# Altium schematic sheet Fusing_Connectors.SchDoc
size A3
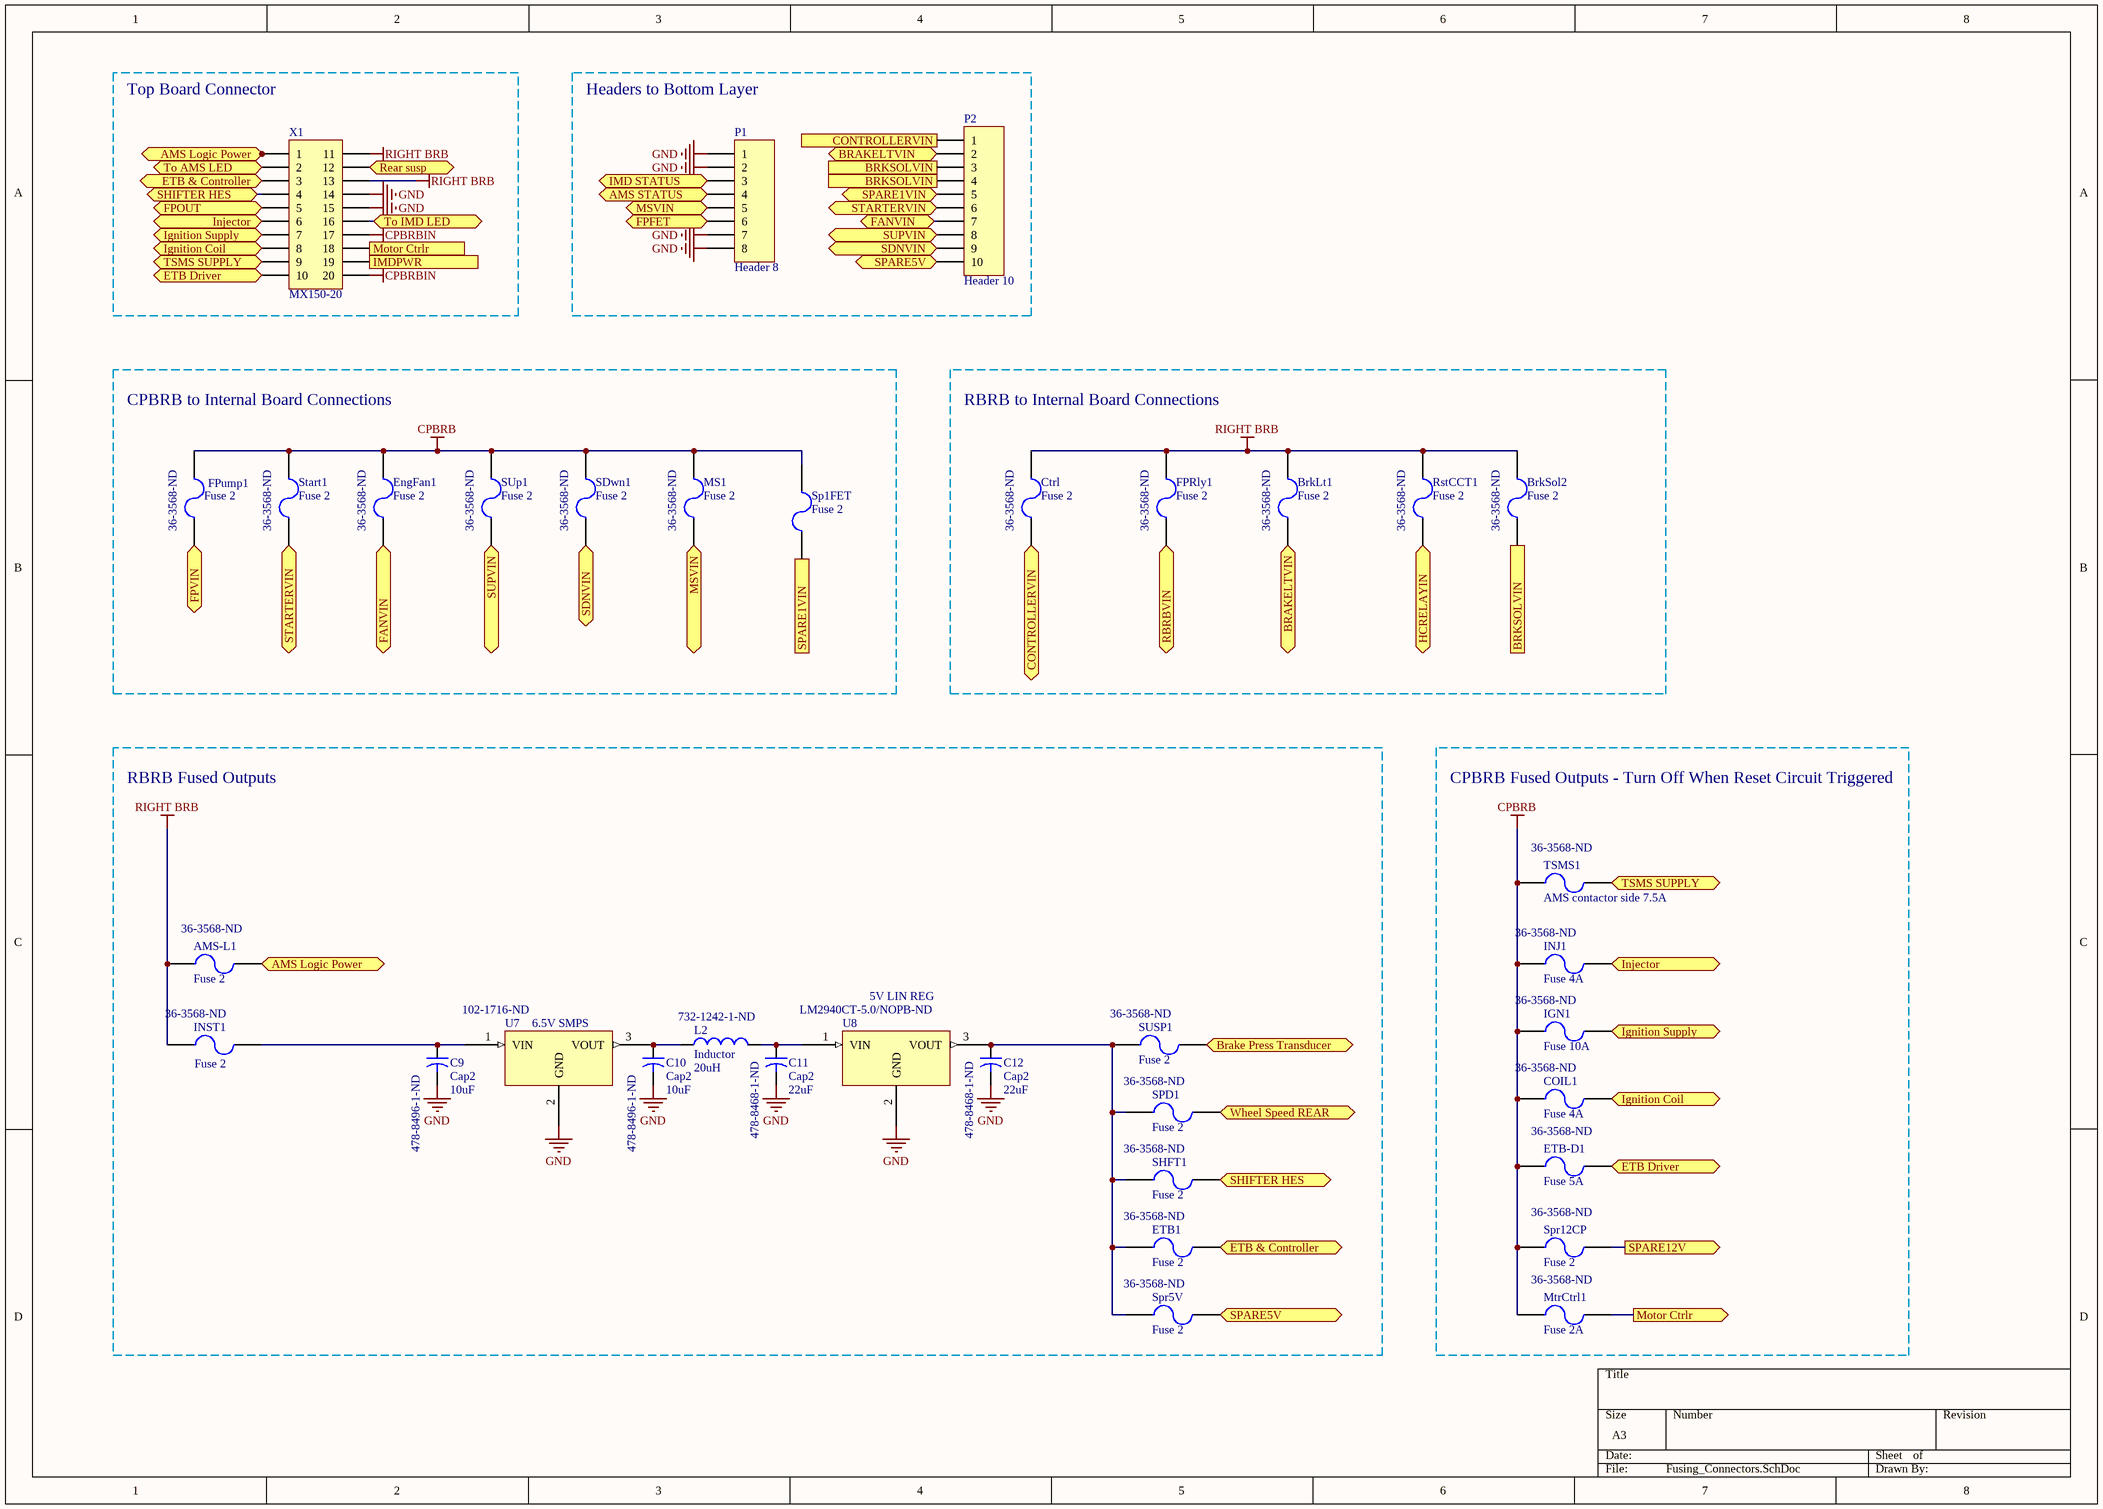
[diagram p0: Fusing_Connectors.SchDoc]

## Parts
AMS-L1  Fuse 2  Supplier Part Number 1: 36-3568-ND  [Fuse Holder Mini ATC/ATO]
BrkLt1  Fuse 2  Supplier Part Number 1: 36-3568-ND  [FUSE HOLDER MINI ATC/ATO]
BrkSol2  Fuse 2  Supplier Part Number 1: 36-3568-ND  [FUSE HOLDER MINI ATC/ATO]
C9  Cap2  value 10uF  Supplier Part Number 1: 478-8496-1-ND  [C1206]
C10  Cap2  value 10uF  Supplier Part Number 1: 478-8496-1-ND  [C1206]
C11  Cap2  value 22uF  Supplier Part Number 1: 478-8468-1-ND  [1206]
C12  Cap2  value 22uF  Supplier Part Number 1: 478-8468-1-ND  [1206]
COIL1  Fuse 4A  Supplier Part Number 1: 36-3568-ND  [Fuse Holder Mini ATC/ATO]
Ctrl  Fuse 2  Supplier Part Number 1: 36-3568-ND  [FUSE HOLDER MINI ATC/ATO]
EngFan1  Fuse 2  Supplier Part Number 1: 36-3568-ND  [FUSE HOLDER MINI ATC/ATO]
ETB1  Fuse 2  Supplier Part Number 1: 36-3568-ND  [Fuse Holder Mini ATC/ATO]
ETB-D1  Fuse 5A  Supplier Part Number 1: 36-3568-ND  [Fuse Holder Mini ATC/ATO]
FPRly1  Fuse 2  Supplier Part Number 1: 36-3568-ND  [FUSE HOLDER MINI ATC/ATO]
FPump1  Fuse 2  Supplier Part Number 1: 36-3568-ND  [FUSE HOLDER MINI ATC/ATO]
IGN1  Fuse 10A  Supplier Part Number 1: 36-3568-ND  [Fuse Holder Mini ATC/ATO]
INJ1  Fuse 4A  Supplier Part Number 1: 36-3568-ND  [Fuse Holder Mini ATC/ATO]
INST1  Fuse 2  Supplier Part Number 1: 36-3568-ND  [Fuse Holder Mini ATC/ATO]
L2  Inductor  value 20uH  Supplier Part Number 1: 732-1242-1-ND  [FILTER INDUCTOR]
MS1  Fuse 2  Supplier Part Number 1: 36-3568-ND  [FUSE HOLDER MINI ATC/ATO]
MtrCtrl1  Fuse 2A  Supplier Part Number 1: 36-3568-ND  [Fuse Holder Mini ATC/ATO]
P1  Header 8  [HDR1X8]
P2  Header 10  [HDR1X10]
RstCCT1  Fuse 2  Supplier Part Number 1: 36-3568-ND  [FUSE HOLDER MINI ATC/ATO]
SDwn1  Fuse 2  Supplier Part Number 1: 36-3568-ND  [FUSE HOLDER MINI ATC/ATO]
SHFT1  Fuse 2  Supplier Part Number 1: 36-3568-ND  [FUSE HOLDER MINI ATC/ATO]
Sp1FET  Fuse 2  [FUSE HOLDER MINI ATC/ATO]
SPD1  Fuse 2  Supplier Part Number 1: 36-3568-ND  [Fuse Holder Mini ATC/ATO]
Spr5V  Fuse 2  Supplier Part Number 1: 36-3568-ND  [Fuse Holder Mini ATC/ATO]
Spr12CP  Fuse 2  Supplier Part Number 1: 36-3568-ND  [Fuse Holder Mini ATC/ATO]
Start1  Fuse 2  Supplier Part Number 1: 36-3568-ND  [FUSE HOLDER MINI ATC/ATO]
SUp1  Fuse 2  Supplier Part Number 1: 36-3568-ND  [FUSE HOLDER MINI ATC/ATO]
SUSP1  Fuse 2  Supplier Part Number 1: 36-3568-ND  [Fuse Holder Mini ATC/ATO]
TSMS1  AMS contactor side 7.5A  Supplier Part Number 1: 36-3568-ND  [Fuse Holder Mini ATC/ATO]
U7  6.5V SMPS  Supplier Part Number 1: 102-1716-ND  [V7806-1000]
U8  5V LIN REG  Supplier Part Number 1: LM2940CT-5.0/NOPB-ND  [TO-220-3]
X1  MX150-20  [20 Pin MX150]

## Blocks framed on the sheet
Top Board Connector: X1
Headers to Bottom Layer: P1 P2
CPBRB to Internal Board Connections: EngFan1 FPump1 MS1 SDwn1 Sp1FET Start1 SUp1
RBRB to Internal Board Connections: BrkLt1 BrkSol2 Ctrl FPRly1 RstCCT1
RBRB Fused Outputs: AMS-L1 C9-C12 ETB1 INST1 L2 SHFT1 SPD1 Spr5V SUSP1 U7 U8
CPBRB Fused Outputs - Turn Off When Reset Circuit Triggered: COIL1 ETB-D1 IGN1 INJ1 MtrCtrl1 Spr12CP TSMS1

## Ports
AMS Logic Power (bidir), AMS STATUS (bidir), Brake Press Transducer (bidir), BRAKELTVIN (bidir), BRKSOLVIN, CONTROLLERVIN, CONTROLLERVIN (bidir), ETB & Controller (bidir), ETB Driver (bidir), FANVIN (bidir), FPFET (bidir), FPOUT (bidir), FPVIN (bidir), HCRELAYIN (bidir), Ignition Coil (bidir), Ignition Supply (bidir), IMD STATUS (bidir), IMDPWR (out), Injector (bidir), Motor Ctrlr (out), MSVIN (bidir), RBRBVIN (bidir), Rear susp (bidir), SDNVIN (bidir), SHIFTER HES (bidir), SPARE1VIN, SPARE1VIN (bidir), SPARE5V (bidir), SPARE12V (out), STARTERVIN (bidir), SUPVIN (bidir), To AMS LED (bidir), To IMD LED (bidir), TSMS SUPPLY (bidir), Wheel Speed REAR (bidir)

## Nets
CPBRB: COIL1.2 EngFan1.2 ETB-D1.2 FPump1.2 IGN1.2 INJ1.2 MS1.2 MtrCtrl1.2 SDwn1.2 Sp1FET.2 Spr12CP.2 Start1.2 SUp1.2 TSMS1.2
CPBRBIN: X1.17 X1.20
GND: C9.2 C10.2 C11.2 C12.2 P1.1 P1.2 P1.7 P1.8 U7.2(GND) U8.2(GND) X1.14 X1.15
RIGHT BRB: AMS-L1.2 BrkLt1.2 BrkSol2.2 Ctrl.2 FPRly1.2 INST1.2 RstCCT1.2 X1.11 X1.13
AMS Logic Power: AMS-L1.1 ; port AMS Logic Power
AMS STATUS: P1.4 ; port AMS STATUS
Brake Press Transducer: SUSP1.1 ; port Brake Press Transducer
BRAKELTVIN: BrkLt1.1 P2.2 ; port BRAKELTVIN
BRKSOLVIN: BrkSol2.1 P2.3 P2.4 ; port BRKSOLVIN
CONTROLLERVIN: Ctrl.1 P2.1 ; port CONTROLLERVIN
ETB & Controller: ETB1.1 X1.3 ; port ETB & Controller
ETB Driver: ETB-D1.1 X1.10 ; port ETB Driver
FANVIN: EngFan1.1 P2.7 ; port FANVIN
FPFET: P1.6 ; port FPFET
FPOUT: X1.5 ; port FPOUT
FPVIN: FPump1.1 ; port FPVIN
HCRELAYIN: RstCCT1.1 ; port HCRELAYIN
Ignition Coil: COIL1.1 X1.8 ; port Ignition Coil
Ignition Supply: IGN1.1 X1.7 ; port Ignition Supply
IMD STATUS: P1.3 ; port IMD STATUS
IMDPWR: X1.19 ; port IMDPWR
Injector: INJ1.1 X1.6 ; port Injector
Motor Ctrlr: MtrCtrl1.1 X1.18 ; port Motor Ctrlr
MSVIN: MS1.1 P1.5 ; port MSVIN
RBRBVIN: FPRly1.1 ; port RBRBVIN
Rear susp: X1.12 ; port Rear susp
SDNVIN: P2.9 SDwn1.1 ; port SDNVIN
SHIFTER HES: SHFT1.1 X1.4 ; port SHIFTER HES
SPARE1VIN: P2.5 Sp1FET.1 ; port SPARE1VIN
SPARE5V: P2.10 Spr5V.1 ; port SPARE5V
SPARE12V: Spr12CP.1 ; port SPARE12V
STARTERVIN: P2.6 Start1.1 ; port STARTERVIN
SUPVIN: P2.8 SUp1.1 ; port SUPVIN
To AMS LED: X1.2 ; port To AMS LED
To IMD LED: X1.16 ; port To IMD LED
TSMS SUPPLY: TSMS1.1 X1.9 ; port TSMS SUPPLY
Wheel Speed REAR: SPD1.1 ; port Wheel Speed REAR
NetC9_1: C9.1 INST1.1 U7.1(VIN)
NetC10_1: C10.1 L2.1 U7.3(VOUT)
NetC11_1: C11.1 L2.2 U8.1(VIN)
NetC12_1: C12.1 ETB1.2 SHFT1.2 SPD1.2 Spr5V.2 SUSP1.2 U8.3(VOUT)

Not connected (* = marked no-connect by the designer): X1 1

## Library data of the parts
AMS-L1 BrkLt1 BrkSol2 Ctrl EngFan1 ETB1 FPump1 INST1 RstCCT1 SDwn1 SHFT1 Sp1FET SPD1 Spr5V Start1 SUp1 SUSP1 = Fuse 2: Fuse; Published: 8-Jun-2000; LatestRevisionDate: 17-Jul-2002; LatestRevisionNote: Re-released for DXP Platform.; PackageReference: PIN-W2/E2.8; Publisher: Altium Limited; PackageDescription: Thru-Hole; 2 Leads; Supplier 1: Digi-Key
  AMS-L1 ETB1 INST1 SHFT1 SPD1 Spr5V SUSP1: Supplier 2: Digi-Key
  Sp1FET: Supplier Part Number 1: 36-3568-ND
C9 = Cap2: Capacitor. Ceramic 10uF 50V rating recommended, place close to pin; Published: 23-Sep-2002; PackageReference: CAPR5-4X5; Publisher: Altium Limited; PackageDescription: Capacitor; 2 Leads; Supplier 1: Digi-Key
C10 = Cap2: Capacitor. Ceramic 10uF 16V recommended. place close to pin; Published: 23-Sep-2002; PackageReference: CAPR5-4X5; Publisher: Altium Limited; PackageDescription: Capacitor; 2 Leads; Supplier 1: Digi-Key
C11 C12 = Cap2: Capacitor; Published: 23-Sep-2002; PackageReference: CAPR5-4X5; Publisher: Altium Limited; PackageDescription: Capacitor; 2 Leads; Supplier 1: Digi-Key
COIL1 = Fuse 2: Fuse Ignition Coil 4A; Published: 8-Jun-2000; LatestRevisionDate: 17-Jul-2002; LatestRevisionNote: Re-released for DXP Platform.; PackageReference: PIN-W2/E2.8; Publisher: Altium Limited; PackageDescription: Thru-Hole; 2 Leads; Supplier 1: Digi-Key; Supplier 2: Digi-Key
ETB-D1 = Fuse 2: Fuse 5A ETB driver; Published: 8-Jun-2000; LatestRevisionDate: 17-Jul-2002; LatestRevisionNote: Re-released for DXP Platform.; PackageReference: PIN-W2/E2.8; Publisher: Altium Limited; PackageDescription: Thru-Hole; 2 Leads; Supplier 1: Digi-Key; Supplier 2: Digi-Key
FPRly1 = Fuse 2: Fuse Relay Coils; Published: 8-Jun-2000; LatestRevisionDate: 17-Jul-2002; LatestRevisionNote: Re-released for DXP Platform.; PackageReference: PIN-W2/E2.8; Publisher: Altium Limited; PackageDescription: Thru-Hole; 2 Leads; Supplier 1: Digi-Key
IGN1 = Fuse 2: Fuse 10A ignition; Published: 8-Jun-2000; LatestRevisionDate: 17-Jul-2002; LatestRevisionNote: Re-released for DXP Platform.; PackageReference: PIN-W2/E2.8; Publisher: Altium Limited; PackageDescription: Thru-Hole; 2 Leads; Supplier 1: Digi-Key; Supplier 2: Digi-Key
INJ1 = Fuse 2: Published: 8-Jun-2000; LatestRevisionDate: 17-Jul-2002; LatestRevisionNote: Re-released for DXP Platform.; PackageReference: PIN-W2/E2.8; Publisher: Altium Limited; PackageDescription: Thru-Hole; 2 Leads; Supplier 1: Digi-Key; Supplier 2: Digi-Key
L2 = Inductor: Code_IEC: 1005; Published: 8-Jun-2000; LatestRevisionDate: 29-May-2009; LatestRevisionNote: IPC-7351 Footprint Added.; PackageReference: 0402-A; Publisher: Altium Limited; PackageDescription: Chip Inductor; Code_JEITA: 0402; Supplier 1: Digi-Key
MS1 = Fuse 2: Microsquirt fuse; Published: 8-Jun-2000; LatestRevisionDate: 17-Jul-2002; LatestRevisionNote: Re-released for DXP Platform.; PackageReference: PIN-W2/E2.8; Publisher: Altium Limited; PackageDescription: Thru-Hole; 2 Leads; Supplier 1: Digi-Key
MtrCtrl1 = Fuse 2: Fuse 2A Motor Controller; Published: 8-Jun-2000; LatestRevisionDate: 17-Jul-2002; LatestRevisionNote: Re-released for DXP Platform.; PackageReference: PIN-W2/E2.8; Publisher: Altium Limited; PackageDescription: Thru-Hole; 2 Leads; Supplier 1: Digi-Key; Supplier 2: Digi-Key
P1 = Header 8: Header, 8-Pin; LatestRevisionDate: 17-Jul-2002; LatestRevisionNote: Re-released for DXP Platform.; Publisher: Altium Limited; Supplier Part Number 1: 952-2121-ND; Supplier 1: Digi-Key
P2 = Header 10: Header, 10-Pin; LatestRevisionDate: 17-Jul-2002; LatestRevisionNote: Re-released for DXP Platform.; Publisher: Altium Limited; Supplier Part Number 1: 952-2121-ND
Spr12CP = Fuse 2: Spare Fuse; Published: 8-Jun-2000; LatestRevisionDate: 17-Jul-2002; LatestRevisionNote: Re-released for DXP Platform.; PackageReference: PIN-W2/E2.8; Publisher: Altium Limited; PackageDescription: Thru-Hole; 2 Leads; Supplier 1: Digi-Key; Supplier 2: Digi-Key
TSMS1 = Fuse 2: Fuse 7.5A; Published: 8-Jun-2000; LatestRevisionDate: 17-Jul-2002; LatestRevisionNote: Re-released for DXP Platform.; PackageReference: PIN-W2/E2.8; Publisher: Altium Limited; PackageDescription: Thru-Hole; 2 Leads; Supplier 1: Digi-Key; Supplier 2: Digi-Key
U7 U8 = Component_1: Supplier 1: Digi-Key
X1 = Header 10X2A: Header, 10-Pin, Dual row; LatestRevisionDate: 17-Jul-2002; LatestRevisionNote: Re-released for DXP Platform.; Publisher: Altium Limited